# Altium schematic sheet ESP32 perifericos.SchDoc: Title
size A4; Date: *******; ApprovedBy: *******; CheckedBy: None; Author: *******; CompanyName: *******; DrawnBy: Name; Engineer: *******; Organization: *******; Address1: *******; Address2: *******; Address3: *******; Address4: *******; DocumentNumber: 2; Revision: *******; SheetNumber: 2; SheetTotal: 3; CurrentTime: *******; CurrentDate: *******; Time: *******; DocumentFullPathAndName: *******; DocumentName: *******; ModifiedDate: *******; ImagePath: *******; ProjectName: *******; Application_BuildNumber: *******
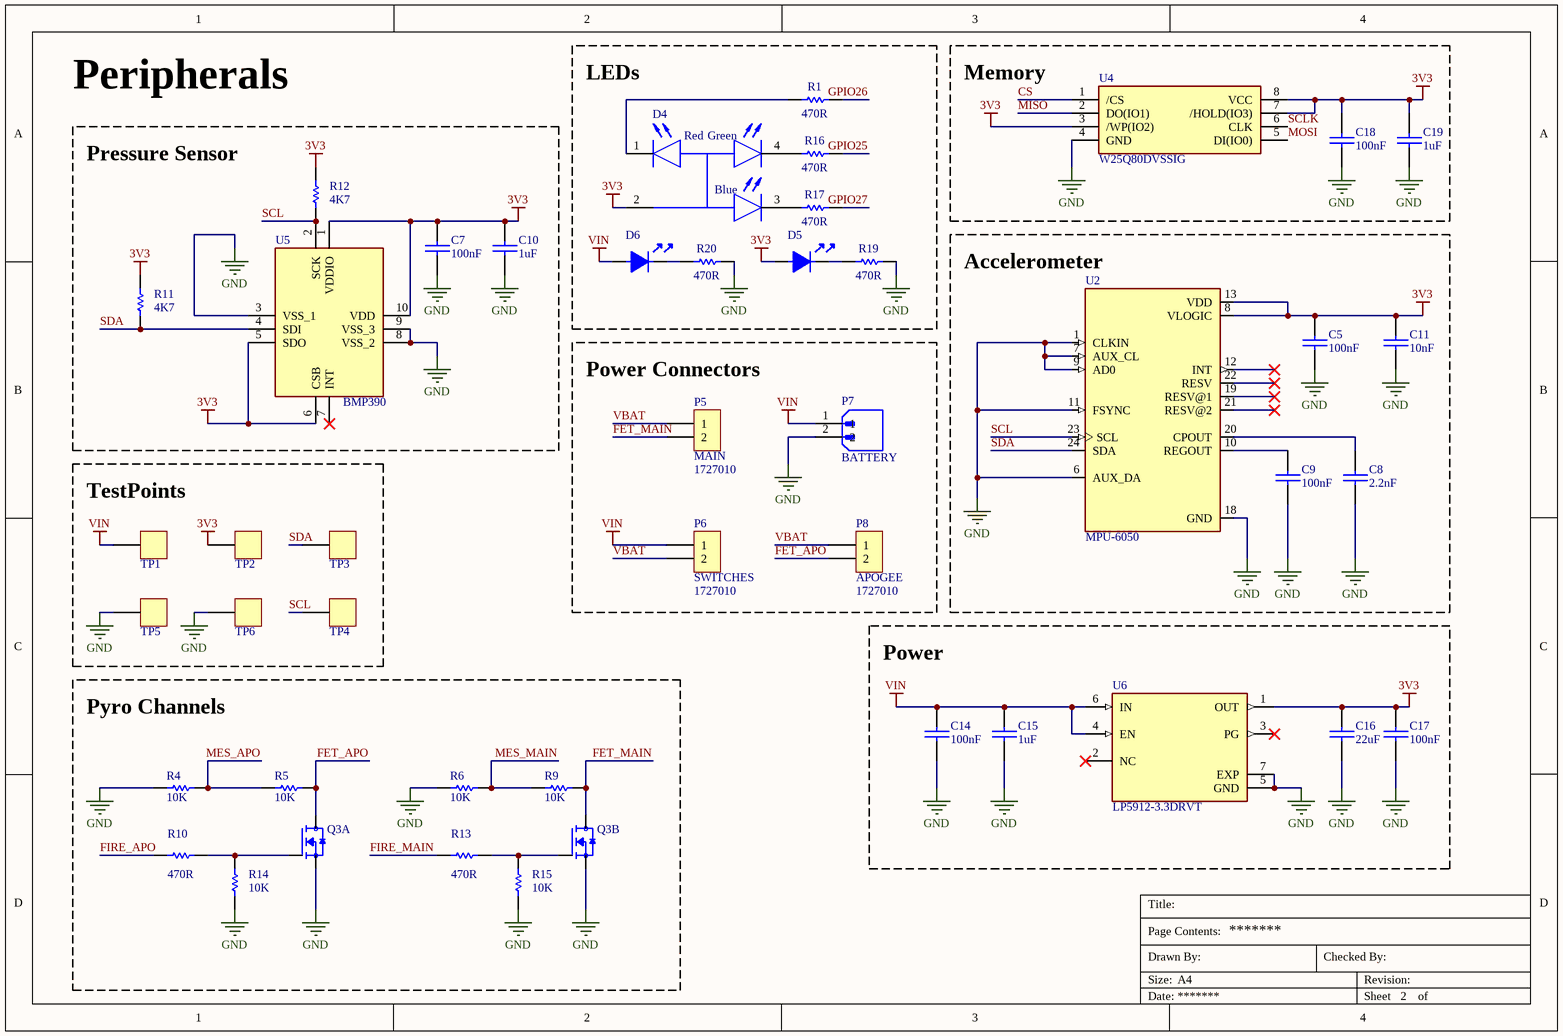
[diagram p0: ESP32 perifericos.SchDoc]

## Parts
C5  value 100nF  [CAPSMD0805]
C7  value 100nF  [CAPSMD0805]
C8  value 2.2nF  [CAPSMD0805]
C9  value 100nF  [CAPSMD0805]
C10  value 1uF  [CAPSMD0805]
C11  value 10nF  [CAPSMD0805]
C14  value 100nF  [CAPSMD0805]
C15  value 1uF  [CAPSMD0805]
C16  value 22uF  [CAPSMD0805]
C17  value 100nF  [CAPSMD0805]
C18  value 100nF  [CAPSMD0805]
C19  value 1uF  [CAPSMD0805]
D4  (no value)  [4-PLCC]
D5  (no value)  [LEDSMD0603]
D6  (no value)  [LEDSMD0603]
P5  MAIN  Manufacturer Part Number: 1727010  [BORNERA2]
P6  SWITCHES  Manufacturer Part Number: 1727010  [BORNERA2]
P7  BATTERY  [JST_BM02B-GHS-TBT(LF)(SN)]
P8  APOGEE  Manufacturer Part Number: 1727010  [BORNERA2]
Q3  (no value)  [TRANS_TSM200N03DPQ33_RGG]  (parts A,B of 2)
R1  value 470R  [0805]
R4  value 10K  [0805]
R5  value 10K  [0805]
R6  value 10K  [0805]
R9  value 10K  [0805]
R10  value 470R  [0805]
R11  value 4K7  [0805]
R12  value 4K7  [0805]
R13  value 470R  [0805]
R14  value 10K  [0805]
R15  value 10K  [0805]
R16  value 470R  [0805]
R17  value 470R  [0805]
R19  value 470R  [0805]
R20  value 470R  [0805]
TP1  VIN  [5015]  (value not drawn)
TP2  3V3  [5015]  (value not drawn)
TP3  SDA  [5015]  (value not drawn)
TP4  SCL  [5015]  (value not drawn)
TP5  GND  [5015]  (value not drawn)
TP6  GND  [5015]  (value not drawn)
U2  (no value)  [QFN24]
U4  (no value)  [SOIC127P790X216-8N]
U5  (no value)  [BMP390]
U6  (no value)  [SON65P200X200X80-7N]

## Blocks framed on the sheet
LEDs: D4-D6 R1 R16 R17 R19 R20
Memory: C18 C19 U4
Pressure Sensor: C7 C10 R11 R12 U5
Accelerometer: C5 C8 C9 C11 U2
Power Connectors: P5-P8
TestPoints: TP1-TP6
Power: C14-C17 U6
Pyro Channels: Q3 R4-R6 R9 R10 R13-R15

## Nets
3V3: C5.2 C7.2 C10.1 C11.1 C16.1 C17.2 C18.2 C19.1 D4.2(A) D5.A R11.2 R12.2 TP2.1 U2.8(VLOGIC) U2.13(VDD) U4.3(/WP(IO2)) U4.7(/HOLD(IO3)) U4.8(VCC) U5.1(VDDIO) U5.5(SDO) U5.6(CSB) U5.10(VDD) U6.1(OUT)
GND: C5.1 C7.1 C8.2 C9.1 C10.2 C11.2 C14.1 C15.2 C16.2 C17.1 C18.1 C19.2 P7.2 Q3.1(S1) Q3.3(S2) R4.1 R6.1 R14.2 R15.2 R19.2 R20.2 TP5.1 TP6.1 U2.1(CLKIN) U2.6(AUX_DA) U2.7(AUX_CL) U2.9(AD0) U2.11(FSYNC) U2.18(GND) U4.4(GND) U5.3(VSS_1) U5.8(VSS_2) U5.9(VSS_3) U6.5(GND) U6.7(EXP)
VIN: C14.2 C15.1 D6.A P6.1 P7.1 TP1.1 U6.4(EN) U6.6(IN)
CS: U4.1(/CS)
FET_APO: P8.2 Q3.7_8(D1) R5.2
FET_MAIN: P5.2 Q3.5_6(D2) R9.2
FIRE_APO: R10.1
FIRE_MAIN: R13.1
GPIO25: R16.2
GPIO26: R1.2
GPIO27: R17.2
MES_APO: R4.2 R5.1
MES_MAIN: R6.2 R9.1
MISO: U4.2(DO(IO1))
MOSI: U4.5(DI(IO0))
SCL: R12.1 TP4.1 U2.23(SCL) U5.2(SCK)
SCLK: U4.6(CLK)
SDA: R11.1 TP3.1 U2.24(SDA) U5.4(SDI)
VBAT: P5.1 P6.2 P8.1
NetC8_1: C8.1 U2.20(CPOUT)
NetC9_2: C9.2 U2.10(REGOUT)
NetD4_1: D4.1(RED_C) R1.1
NetD4_3: D4.3(BLUE_C) R17.1
NetD4_4: D4.4(GREEN_C) R16.1
NetD5_K: D5.K R19.1
NetD6_K: D6.K R20.1
NetQ3_2: Q3.2(G1) R10.2 R14.1
NetQ3_4: Q3.4(G2) R13.2 R15.1

Not connected (* = marked no-connect by the designer): U2 12(INT)* 19(RESV@1)* 21(RESV@2)* 22(RESV)*; U5 7(INT)*; U6 2(NC)* 3(PG)*

## Notes on the sheet
- Peripherals
- Title:
- Size:
- Date:
- Drawn By:
- Page Contents:
- A4
- Checked By:
- Revision:
- Sheet
- of
- (in symbol LED RGB) Red; Green; Blue

## Library data of the parts
C5 C7 C9 C14 C17 C18 = CAP: Capacitor SMD 4.7nF; Manufacturer: FH (Guangdong Fenghua Advanced Tech); Manufacturer Part Number: 0805B104M500NT; Supplier: JLCPCB; Supplier Part Number: C286511
C8 = CAP: Capacitor SMD 4.7nF; Manufacturer: YAGEO; Manufacturer Part Number: CC0805JRX7R0BB222; Supplier: JLCPCB; Supplier Part Number: C527219
C10 C15 C19 = CAP: Capacitor SMD 4.7nF; Manufacturer: FH (Guangdong Fenghua Advanced Tech); Manufacturer Part Number: 0805F105Z250NT; Supplier: JLCPCB; Supplier Part Number: C285184
C11 = CAP: Capacitor SMD 4.7nF; Manufacturer: PSA(Prosperity Dielectrics); Manufacturer Part Number: FN21X103K500PXG; Supplier: JLCPCB; Supplier Part Number: C525298
C16 = CAP: Capacitor SMD 4.7nF; Manufacturer: Samsung Electro-Mechanics; Manufacturer Part Number: CL21A226KPCLRNC; Supplier: JLCPCB; Supplier Part Number: C318688
D4 = LED RGB: Red, Green, Blue _RGB_ 622nm Red, 530nm Green, 470nm Blue LED Indication - Discrete 1.9V Red, 3V Green, 3V Blue 4-PLCC; Manufacturer: CREELED, INC.; Manufacturer Part Number: CLVBA-FKA-CAEDH8BBB7A363; Supplier: JLCPCB; Supplier Part Number: C5250259
D5 D6 = LED: LED SMD Verde; Manufacturer: Everlight Elec; Manufacturer Part Number: 19-217/R6C-AL1M2VY/3T; Supplier: JLCPCB; Supplier Part Number: C72044
P5 P6 P8 = BORNERA 2: 13.5A 200V Green Straight pin 3.81mm 1 2 Plugin,P=3.81mm  Screw terminal ROHS; Manufacturer: Phoenix Contact; Supplier: JLCPCB; Supplier Part Number: C89123
P7 = BM02B-GHS-TBT(LF)(SN): Connector Header Surface Mount 2 position 0.049 (1.25mm); Manufacturer: JST Sales America; Manufacturer Part Number: BM02B-GHS-TBT(LF)(SN); Supplier: JLCPCB; Supplier Part Number: C161690
Q3 = TSM200N03DPQ33_RGG: MOSFET 2 N-CH 30V 20A 8PDFN; Manufacturer: Taiwan Semiconductor Corporation; Manufacturer Part Number: TSM200N03DPQ33 RGG; Supplier: Digikey; Supplier Part Number: TSM200N03DPQ33RGGCT-ND
R1 R10 R13 R16 R17 R19 R20 = RES: Resistencia SMD 470ohms; Manufacturer: UNI-ROYAL(Uniroyal Elec); Manufacturer Part Number: CQ05W8J0471T5E; Supplier: JLCPCB; Supplier Part Number: C473621
R4-R6 R9 R14 R15 = RES: Resistencia SMD 470ohms; Manufacturer: Viking Tech; Manufacturer Part Number: ARG05BTC1002; Supplier: JLCPCB; Supplier Part Number: C406725
R11 R12 = RES: Resistencia SMD 470ohms; Manufacturer: Viking Tech; Manufacturer Part Number: CR-05FL7---4K7; Supplier: JLCPCB; Supplier Part Number: C280006
TP1-TP6 = TESTPOINT_5015: Thimble/Copper Rod/Test Ring ROHS; Manufacturer: Ronghe; Manufacturer Part Number: RH-5015; Supplier: JLCPCB; Supplier Part Number: C5199798
U2 = MPU-6050: MPU-6050 series Accelerometer, Gyroscope, 3 Axis Sensor Evaluation Board; Manufacturer: TDK InvenSense; Manufacturer Part Number: MPU-6050; Supplier: JLCPCB; Supplier Part Number: C24112
U4 = W25Q80DVSSIG: 8M-bit 3.0V Serial Flash Memory with uniform 4KB sectors and Dual/Quad SPI; Manufacturer: Winbond Elec; Manufacturer Part Number: W25Q80DVSSIG; Supplier: JLCPCB; Supplier Part Number: C14086
U5 = BMP390: Board Mount Pressure Sensors; Manufacturer: BOSCH; Manufacturer Part Number: BMP390; Supplier: JLCPCB; Supplier Part Number: C5124834
U6 = LP5912-3.3DRVT: 500-mA, low-noise, low-IQ, low-dropout voltage regulator with reverse current protection 6-WSON -40 to 125; Manufacturer: Texas Instruments; Manufacturer Part Number: LP5912-3.3DRVT; Supplier: JLCPCB; Supplier Part Number: C134121